# Altium schematic sheet SigmaDelta.SCHDOC: LiveDesign Evaluation - Video Games
size A; Organization: Altium Limited; Address1: L3, 12a Rodborough Rd; Address2: Frenchs Forest; Address3: NSW; Address4: Australia 2086; DocumentNumber: 13; SheetNumber: 13; SheetTotal: 13
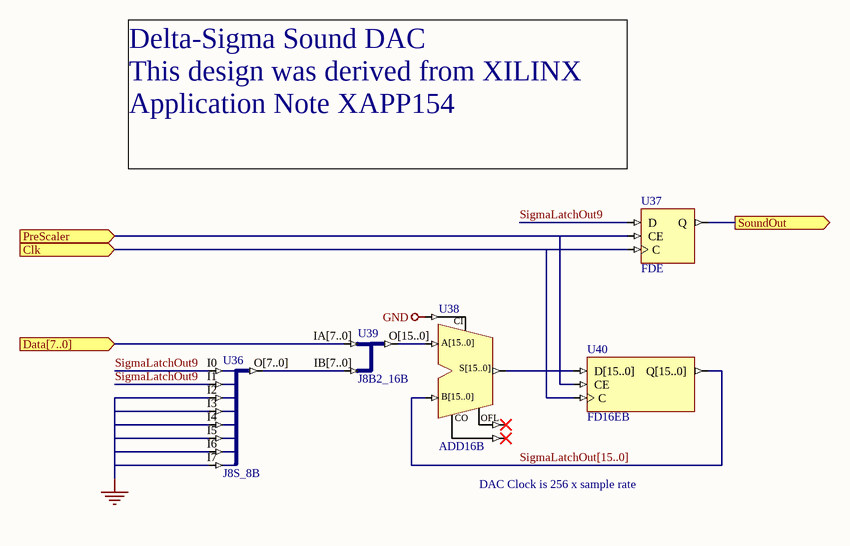
[diagram p0: SigmaDelta.SCHDOC]

## Parts
U36  J8S_8B
U37  FDE
U38  ADD16B
U39  J8B2_16B
U40  FD16EB

## Ports
Clk (in), Data[7..0] (in), PreScaler (in), SoundOut (out)

## Nets
GND: U36.I2 U36.I3 U36.I4 U36.I5 U36.I6 U36.I7 U38.CI
Clk: U37.C U40.C ; port Clk
Data[7..0]: U39.IA[7..0] ; port Data[7..0]
PreScaler: U37.CE U40.CE ; port PreScaler
SigmaLatchOut9: U36.I0 U36.I1 U37.D
SigmaLatchOut[15..0]: U38.B[15..0] U40.Q[15..0]
SoundOut: U37.Q ; port SoundOut
NetU36_O[7..0]: U36.O[7..0] U39.IB[7..0]
NetU38_A[15..0]: U38.A[15..0] U39.O[15..0]
NetU38_S[15..0]: U38.S[15..0] U40.D[15..0]

Not connected (* = marked no-connect by the designer): U38 CO* OFL*

## Buses and harness runs
bus SigmaLatchOut[15..0]

## Notes on the sheet
- Delta-Sigma Sound DAC
  This design was derived from XILINX Application Note XAPP154
- (near U38) DAC Clock is 256 x sample rate
- Title
- Size:
- Date:
- A
- Number:
- Time:
- Revision:
- Sheet
- of
- File:

## Library data of the parts
U36 = J8S_8B: 8 Single pin inputs to single 8-Bit output bus; ArchiveName: GENERIC; Published: 18-Dec-2003; Publisher: Altium Limited; Core Revision: 1.00.00
U37 = FDE: D Flip-Flop with Clock Enable; ArchiveName: GENERIC; Published: 18-Dec-2003; Publisher: Altium Limited; Core Revision: 1.00.00
U38 = ADD16B: 16-Bit Cascadable Full Adder with Carry In, Carry Out and Overflows, Bus Version; Xilinx Equivalent: ADD16; ArchiveName: GENERIC; Published: 18-Dec-2003; Publisher: Altium Limited; Core Revision: 1.00.00
U39 = J8B2_16B: 2 x 8-Bit input bus to 1 x 16-bit output bus; ArchiveName: GENERIC; Published: 18-Dec-2003; Publisher: Altium Limited; Core Revision: 1.00.00
U40 = FD16EB: 16-Bit D Flip-Flop with Clock Enable, Bus Version; ArchiveName: GENERIC; Published: 7-Nov-2003; Publisher: Altium Limited; Core Revision: 1.00.00